# EasyEDA Pro project Modu-PI Motherboard.epro, schematic Schematic1
Create Date: 2025-08-20; Page Name: P1; Project Name: Modular Motherboard CM5; Schematic Name: Schematic1; Update Date: 2025-09-23; Company: EasyEDA.com; Page Size: A4; Version: V1.0
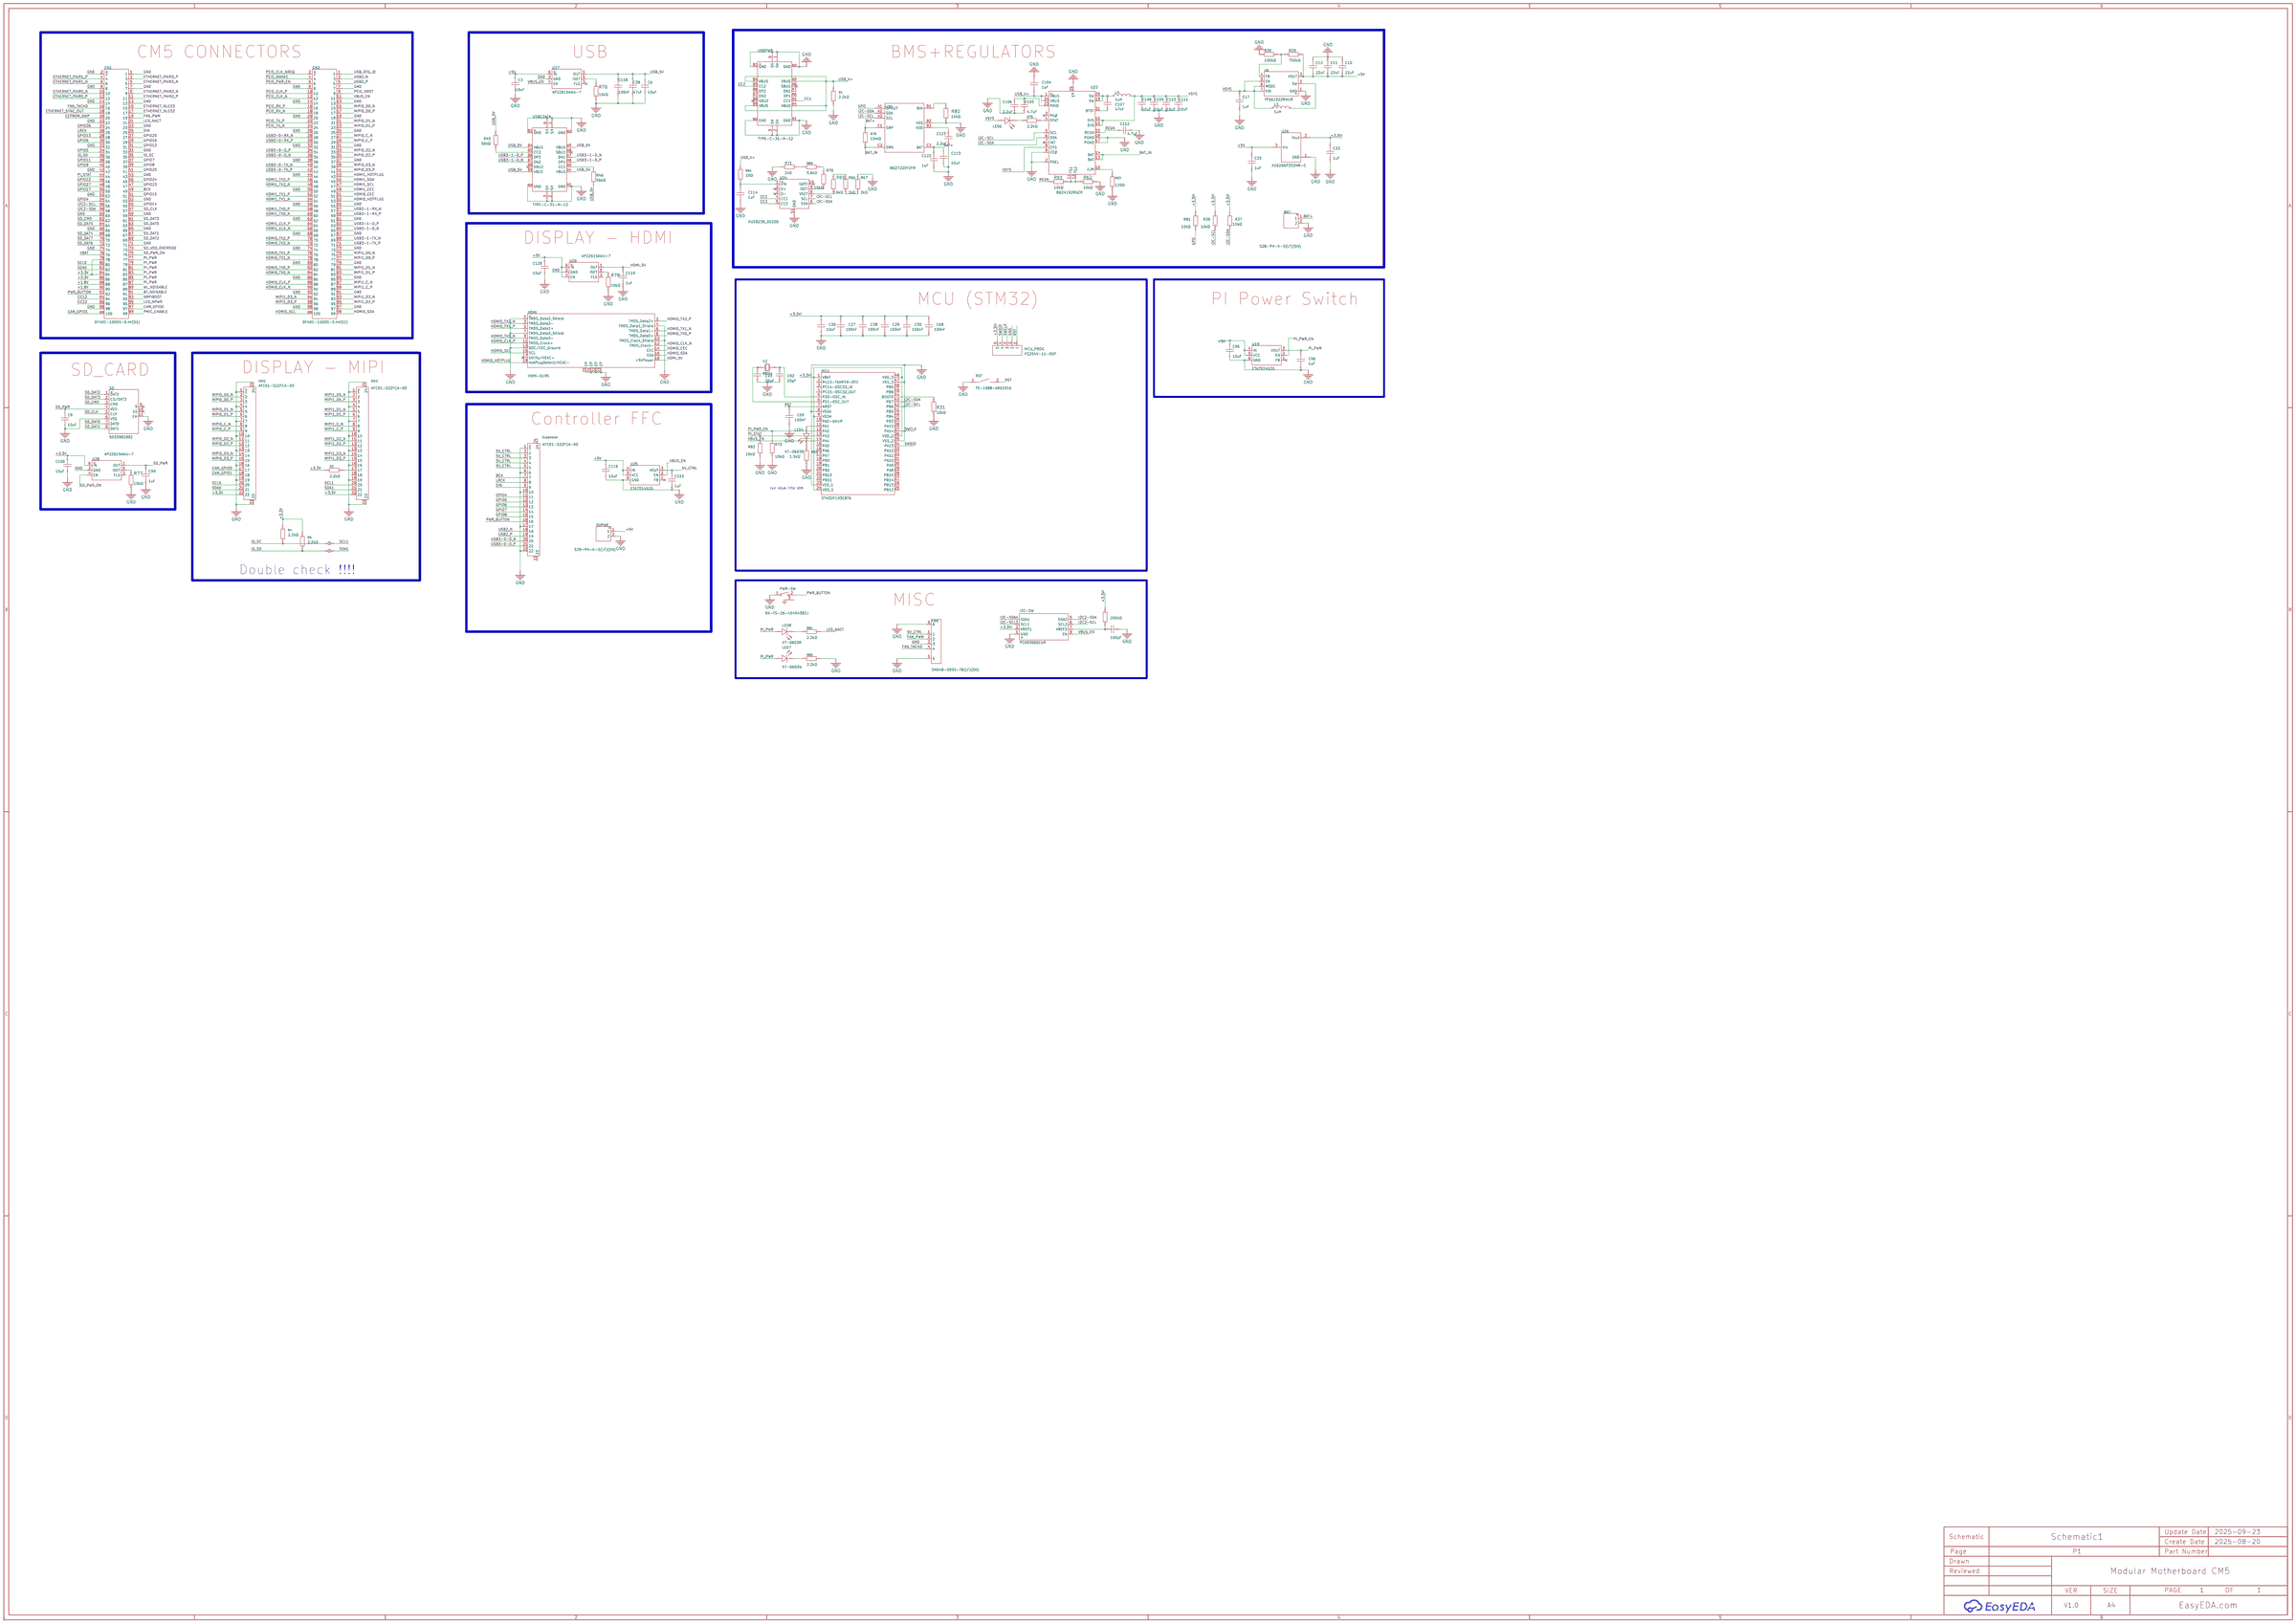
[diagram p0: schematic sheet]

## Parts
5VPWR  S2B-PH-K-S(LF)(SN)  [CONN-TH_S2B-PH-K-S-LF-SN]  (no BOM)
BAT  S2B-PH-K-S(LF)(SN)  [CONN-TH_S2B-PH-K-S-LF-SN]  (no BOM)
C3  10uF  [C0805]
C6  10uF  [C0805]
C9  10uF  [C0805]
C10  22uF  [C0805]
C11  22uF  [C0805]
C12  22uF  [C0805]
C17  1uF  [C0603]
C25  1uF  [C0603]
C26  10uF  [C0805]
C27  100nF  [C0402]
C28  100nF  [C0402]
C29  100nF  [C0402]
C30  100nF  [C0402]
C33  1uF  [C0603]
C38  47uF  [C1206]
C68  100nF  [C0402]
C69  100nF  [C0402]
C92  20pF  [C0402]
C93  20pF  [C0402]
C95  10uF  [C0805]
C96  1uF  [C0603]
C99  1uF  [C0603]
C100  10uF  [C0805]
C104  1uF  [C0603]
C105  4.7uF  [C0805]
C106  2.2uF  [C0805]
C107  47nF  [C0603]
C108  10uF  [C0805]
C109  10uF  [C0805]
C110  10uF  [C0805]
C111  10uF  [C0805]
C112  4.7uF  [C0603]
C113  10uF  [C0805]
C114  1uF  [C0603]
C115  1uF  [C0603]
C116  10uF  [C0805]
C118  100nF  [C0402]
C119  1uF  [C0603]
C120  10uF  [C0805]
C122  1uF  [C0603]
C123  2.2uF  [C0805]
C124  100pF  [C0603]
CN1  DF40C-100DS-0.4V(51)  [CONN-SMD_DF40C-100DS-0.4V-51]
CN2  DF40C-100DS-0.4V(51)  [CONN-SMD_DF40C-100DS-0.4V-51]
DSI0  AFC01-S22FCA-00  [FPC-SMD_P0.5-22P_FGS-XJ-H2.0]
DSI1  AFC01-S22FCA-00  [FPC-SMD_P0.5-22P_FGS-XJ-H2.0]
Expansion  AFC01-S22FCA-00  [FPC-SMD_P0.5-22P_FGS-XJ-H2.0]
FAN  SM04B-SRSS-TB(LF)(SN)  [CONN-SMD_4P-P1.00_SM04B-SRSS-TB-LF-SN]
HDMI  HDMI-519S  [HDMI-SMD_19P-P0.40-H-F_HDMI-519S]
I2C-SW  PCA9306DCUR  [SSOP-8_L2.0-W2.3-P0.50-LS3.1-BR]
L3  1uH  [IND-SMD_L4.4-W4.2]
L4  1uH  [IND-SMD_L4.4-W4.2]
LED4  KT-0603R  [LED0603-RD]
LED6  KT-0603R  [LED0603-RD]
LED7  KT-0603W  [LED0603-R-RD_WHITE]
LED8  KT-0603R  [LED0603-RD]
MCU  STM32F103C8T6  [LQFP-48_L7.0-W7.0-P0.50-LS9.0-BL]
MCU_PROG  PZ254V-11-05P  [HDR-TH_5P-P2.54-V-M]  (no BOM)
PWR-SW  BX-TS-26-454543BSJ  [SW-TH_3P-L4.5-W4.3-P3.00-LS1.9]  (no BOM)
R1  2.2kΩ  [R0402]
R3  2.2kΩ  [R0402]
R4  2.2kΩ  [R0402]
R5  2.2kΩ  [R0402]
R29  750kΩ  [R0603]
R30  100kΩ  [R0603]
R31  10kΩ  [R0603]
R32  1.5kΩ  [R0402]
R37  10kΩ  [R0402]
R38  10kΩ  [R0402]
R45  56kΩ  [R0402]
R46  56kΩ  [R0402]
R61  10kΩ  [R0603]
R62  10kΩ  [R0603]
R63  120Ω  [R0603]
R64  10Ω  [R0603]
R65  10kΩ  [R0603]
R66  2kΩ  [R0603]
R67  2kΩ  [R0603]
R69  5.6kΩ  [R0603]
R70  15kΩ  [R0603]
R71  2kΩ  [R0603]
R72  10kΩ  [R0402]
R75  2.2kΩ  [R0402]
R76  10kΩ  [R0603]
R77  10kΩ  [R0603]
R78  10kΩ  [R0603]
R79  10mΩ  [R1210]
R80  10kΩ  [R0603]
R81  10kΩ  [R0402]
R82  10kΩ  [R0402]
R84  2.2kΩ  [R0402]
R85  2.2kΩ  [R0402]
R86  200kΩ  [R0603]
RST  TS-1088-AR02016  [SW-SMD_L3.9-W3.0-P4.45]
SD  5033981892  [TF-SMD_503398-1892]
U9  TPS61022RWUR  [VQFN-7_L2.0-W2.0-P0.55-TL_RWU]
U19  ETA7014S2G  [SOT-23-6_L2.9-W1.6-P0.95-LS2.8-BL]
U23  BQ24192RGER  [QFN-24_L4.0-W4.0-P0.50-BL-EP2.7]
U24  HUSB238_002DD  [DFN-10_L3.0-W3.0-P0.50-BL-EP2.5]
U25  ETA7014S2G  [SOT-23-6_L2.9-W1.6-P0.95-LS2.8-BL]
U26  XC6206P332MR-G  [SOT-23-3_L2.9-W1.6-P1.90-LS2.8-BR]
U27  AP22615AWU-7  [SOT-26_L3.0-W1.6-P0.95-LS2.8-BL]
U28  AP22615AWU-7  [SOT-26_L3.0-W1.6-P0.95-LS2.8-BL]
U29  AP22615AWU-7  [SOT-26_L3.0-W1.6-P0.95-LS2.8-BL]
U30  BQ27220YZFR  [DSBGA-9_L1.7-W1.6-R3-C3-P0.50-BL]
USBCDATA  TYPE-C-31-M-12  [USB-C_SMD-TYPE-C-31-M-12]
USBPWR  TYPE-C-31-M-12  [USB-C_SMD-TYPE-C-31-M-12]
X2  8MHz  [CRYSTAL-SMD_L5.0-W3.2]

## Library data of the parts
5VPWR BAT = S2B-PH-K-S(LF)(SN): Pins Structure:1x2P Pitch:2mm Mounting Type:Right Angle Reference Series:PH Number of Pins:2P Number of Rows:1 Number of PINs Per Row:2 Row Spacing:- Current Rating:2A Contact Material:Brass Contact Plating:Tin Operating Temperature:-25℃~+85℃ Operating Te; LCSC Part Name: 1x2P 间距:2mm 弯插 系列:PH; Supplier Part: C173752; Manufacturer: JST; Supplier Footprint: 弯插,P=2mm; JLCPCB Part Class: Extended Part; Datasheet: https://item.szlcsc.com/datasheet/S2B-PH-K-S(LF)(SN)/185142.html; Supplier: LCSC; Pins Structure: 1x2P; Pitch: 2mm; Mounting Type: Right Angle; Reference Series: PH; Number of Pins: 2P; Number of Rows: 1; Number of PINs Per Row: 2; Current Rating: 2A; Contact Material: Brass; Contact Plating: Tin; Operating Temperature: -25℃~+85℃; Voltage Rating: 100V; Plastic Material: PA66; Flame Retardant Rating: UL94V-0; Supplementary Features: K Pin; Color: White; Z-Height of the Board: 4.8mm; X-Length of Bottom Edge on Board (Spacing Line): 5.9mm; Y-Width of Bottom Edge on Board: 7.6mm
C3 C6 C9 C26 C95 C100 C108-C111 C113 C116 C120 = CL21A106KAYNNNE_C15850: Capacitance: Tolerance:±10% Tolerance:±10% Voltage Rated: Temperature Coefficient:; LCSC Part Name: 10uF ±10% 25V; Supplier Part: C15850; Manufacturer: SAMSUNG(三星); Manufacturer Part: CL21A106KAYNNNE; Supplier Footprint: 0805; JLCPCB Part Class: Basic Part; Datasheet: https://atta.szlcsc.com/upload/public/pdf/source/20160218/1457707763339.pdf; Supplier: LCSC; Tolerance: ±10%
C10-C12 = CL21A226MAQNNNE: Capacitance: Tolerance:±20% Tolerance:±20% Voltage Rated: Temperature Coefficient:; LCSC Part Name: 22uF ±20% 25V; Supplier Part: C45783; Manufacturer: SAMSUNG(三星); Supplier Footprint: 0805; JLCPCB Part Class: Basic Part; Datasheet: https://atta.szlcsc.com/upload/public/pdf/source/20160218/1457707763339.pdf; Supplier: LCSC; Tolerance: ±20%
C17 C25 C33 C96 C99 C104 C114 C115 C119 C122 = CL10A105KB8NNNC: Capacitance: Tolerance:±10% Tolerance:±10% Voltage Rated: Temperature Coefficient:; LCSC Part Name: 1uF ±10% 50V; Supplier Part: C15849; Manufacturer: SAMSUNG(三星); Supplier Footprint: 0603; JLCPCB Part Class: Basic Part; Datasheet: https://atta.szlcsc.com/upload/public/pdf/source/20160218/1457707763339.pdf; Supplier: LCSC; Tolerance: ±10%
C27-C30 C68 C69 C118 = CL05B104KB54PNC: Capacitance: Tolerance:±10% Tolerance:±10% Voltage Rated: Temperature Coefficient:; LCSC Part Name: 100nF ±10% 50V; Supplier Part: C307331; Manufacturer: SAMSUNG(三星); Supplier Footprint: 0402; JLCPCB Part Class: Basic Part; Datasheet: https://atta.szlcsc.com/upload/public/pdf/source/20160218/1457707763339.pdf; Supplier: LCSC; Tolerance: ±10%
C38 = CL31A476MPHNNNE: Capacitance: Tolerance:±20% Tolerance:±20% Voltage Rated: Temperature Coefficient:; LCSC Part Name: 47uF ±20% 10V; Supplier Part: C96123; Manufacturer: SAMSUNG(三星); Supplier Footprint: 1206; JLCPCB Part Class: Basic Part; Datasheet: https://atta.szlcsc.com/upload/public/pdf/source/20160218/1457707763339.pdf; Supplier: LCSC; Tolerance: ±20%
C92 C93 = 0402CG200J500NT: Capacitance: Tolerance:±5% Tolerance:±5% Voltage Rated: Temperature Coefficient:; LCSC Part Name: 20pF ±5% 50V; Supplier Part: C1554; Manufacturer: FH(风华); Supplier Footprint: 0402; JLCPCB Part Class: Basic Part; Datasheet: https://atta.szlcsc.com/upload/public/pdf/source/20200305/C486355_26A10D38EF8C2A5C37091D0039909270.pdf; Supplier: LCSC; Tolerance: ±5%
C105 = CL21A475KAQNNNE: Capacitance:4.7uF Tolerance:±10% Tolerance:±10% Voltage Rating:25V Temperature Coefficient:X5R; LCSC Part Name: 4.7uF ±10% 25V; Supplier Part: C1779; Manufacturer: SAMSUNG(三星); Supplier Footprint: 0805; JLCPCB Part Class: Basic Part; Datasheet: https://item.szlcsc.com/datasheet/CL21A475KAQNNNE/2131.html; Supplier: LCSC; Tolerance: ±10%; Voltage Rating: 25V; Temperature Coefficient: X5R
C106 C123 = CL21A225KBQNNNE: Capacitance:2.2uF Tolerance:±10% Tolerance:±10% Voltage Rating:50V Temperature Coefficient:X5R; LCSC Part Name: 2.2uF ±10% 50V; Supplier Part: C377773; Manufacturer: SAMSUNG(三星); Supplier Footprint: 0805; JLCPCB Part Class: Basic Part; Datasheet: https://item.szlcsc.com/datasheet/CL21A225KBQNNNE/350246.html; Supplier: LCSC; Tolerance: ±10%; Voltage Rating: 50V; Temperature Coefficient: X5R
C107 = CL10B473KB8NNNC: Capacitance: Tolerance:±10% Tolerance:±10% Voltage Rated: Temperature Coefficient:; LCSC Part Name: 47nF ±10% 50V; Supplier Part: C1622; Manufacturer: SAMSUNG(三星); Supplier Footprint: 0603; JLCPCB Part Class: Basic Part; Datasheet: https://atta.szlcsc.com/upload/public/pdf/source/20160218/1457707763339.pdf; Supplier: LCSC; Tolerance: ±10%
C112 = CL10A475KO8NNNC: Capacitance: Tolerance:±10% Tolerance:±10% Voltage Rated: Temperature Coefficient:; LCSC Part Name: 4.7uF ±10% 16V; Supplier Part: C19666; Manufacturer: SAMSUNG(三星); Supplier Footprint: 0603; JLCPCB Part Class: Basic Part; Datasheet: https://atta.szlcsc.com/upload/public/pdf/source/20160218/1457707763339.pdf; Supplier: LCSC; Tolerance: ±10%
C124 = CL10C101JB8NNNC: Capacitance:100pF Tolerance:±5% Tolerance:±5% Voltage Rating:50V Temperature Coefficient:C0G; LCSC Part Name: 100pF ±5% 50V; Supplier Part: C14858; Manufacturer: SAMSUNG(三星); Supplier Footprint: 0603; JLCPCB Part Class: Basic Part; Datasheet: https://item.szlcsc.com/datasheet/CL10C101JB8NNNC/15530.html; Supplier: LCSC; Tolerance: ±5%; Voltage Rating: 50V; Temperature Coefficient: C0G
CN1 CN2 = DF40C-100DS-0.4V(51): Number of Pins:- Pitch:0.4mm Mounting Type:Surface Mount,Vertical Number of Rows:2 Current Rating:300mA Contact Plating:Gold Operating Temperature:-35℃~+85℃ Operating Temperature:-35℃~+85℃; LCSC Part Name: 间距:0.4mm 母 立贴; Supplier Part: C597931; Manufacturer: HRS(广濑); Supplier Footprint: SMD,P=0.4mm; JLCPCB Part Class: Extended Part; Datasheet: https://item.szlcsc.com/datasheet/DF40C-100DS-0.4V(51)/626547.html; Supplier: LCSC; Pitch: 0.4mm; Gender: Female; Mounting Style: Brick nogging; Number of Rows: 2; Current Rating (Max): 300mA; Contact Plating: Gold; Operating Temperature Range: -35℃~+85℃; Mounting Type: Surface Mount,Vertical; Current Rating: 300mA; Operating Temperature: -35℃~+85℃
DSI0 DSI1 Expansion = AFC01-S22FCA-00: Locking Feature:Clamshell Contact Type:Bottom Contact Number of Contacts:22P Pitch:0.5mm Mounting Type:卧贴 FFC, FCB Thickness:0.3mm FFC, FCB Thickness:0.3mm Height Above Board:2mm; LCSC Part Name: 间距:0.5mm P数:22P 翻盖式 下接; Supplier Part: C262668; Manufacturer: JS(钜硕电子); Supplier Footprint: SMD,P=0.5mm,卧贴; JLCPCB Part Class: Extended Part; Datasheet: https://atta.szlcsc.com/upload/public/pdf/source/20190816/C413942_2A72D1AC756EAE17EEDF756A339D4500.pdf; Supplier: LCSC; Locking Feature: Clamshell; Contact Type: Bottom Contact; Number of Contacts: 22P; Pitch: 0.5mm; Mounting Type: 卧贴; FFC, FCB Thickness: 0.3mm; Height Above Board: 2mm; Contact Material: Phosphor bronze; Contact Plating: Gold; Operating Temperature Range: -40℃~+85℃
FAN = SM04B-SRSS-TB(LF)(SN): Pins Structure:1x4P Pitch:1mm Mounting Style:Horizontal attachment Reference Series:SH Number of Pins:4P Number of Rows:1 Number of PINs Per Row:4 Row Spacing:- Current Rating (Max):1A Contact Material:Copper alloy Contact Plating:Tin Operating Temperatur; LCSC Part Name: 1x4P 间距:1mm 卧贴 系列:SH; Supplier Part: C160404; Manufacturer: JST; Supplier Footprint: SMD,P=1mm,卧贴; JLCPCB Part Class: Extended Part; Datasheet: https://atta.szlcsc.com/upload/public/pdf/source/20181010/C265335_7D2AD766CA0E20E745663C87507A223E.pdf; Supplier: LCSC; Pins Structure: 1x4P; Pitch: 1mm; Mounting Style: Horizontal attachment; Reference Series: SH; Number of Pins: 4P; Number of Rows: 1; Number of PINs Per Row: 4; Current Rating (Max): 1A; Contact Material: Copper alloy; Contact Plating: Tin; Operating Temperature Range: -25℃~+85℃; Rated Voltage (Max): 50V; Plastic Material: PA; Flame Retardant Rating: UL94V-0; Supplementary Features: Auxiliary soldering legs; Colour: White; Z-Height of the Board: 2.9mm; X-Length of Bottom Edge on Board (Spacing Line): 6mm; Y-Width of Bottom Edge on Board: 4.32mm
HDMI = HDMI-519S: Connector Type:HDMI-C Gender:Mother Number of Pins:19P Mounting Style:Horizontal attachment Current Rating (Max):- Rated Voltage (Max):- Operating Temperature Range:-10℃~+60℃ Operating Temperature Range:-10℃~+60℃; Supplier Part: C183605; Manufacturer: SOFNG(硕方); Supplier Footprint: SMD; JLCPCB Part Class: Extended Part; Datasheet: https://atta.szlcsc.com/upload/public/pdf/source/20180308/C183605_15204898542661414122.pdf; Supplier: LCSC; Connector Type: HDMI-C; Gender: Mother; Number of Pins: 19P; Mounting Style: Horizontal attachment; Operating Temperature Range: -10℃~+60℃
I2C-SW = PCA9306DCUR: Channel Type:Bidirectional Input Signal:- Output Signal:- Data Rate:- Voltage - Supply(VCCA):1.2V~3.3V Voltage - Supply(VCCA):1.2V~3.3V Voltage - Supply(VCCB):1.8V~5.5V Voltage - Supply(VCCB):1.8V~5.5V Number of Circuits:1 Number of Circuits:2 Output Type; LCSC Part Name: 2位双向电平转换器; Supplier Part: C33196; Manufacturer: TI(德州仪器); Supplier Footprint: VSSOP-8; JLCPCB Part Class: Extended Part; Datasheet: https://www.ti.com/cn/lit/gpn/pca9306; Supplier: LCSC; Channel Type: Bidirectional; Voltage - Supply(VCCA): 1.2V~3.3V; Voltage - Supply(VCCB): 1.8V~5.5V; Number of Circuits: 2; Output Type: Open Drain；Push-pull; Operating Temperature: -40℃~+85℃; Features: Automatic Direction Detection
L3 L4 = FXL0420-1R0-M: Inductance: Tolerance:±20% Tolerance:±20% Rated Current: Saturation Current (Isat):7A DC Resistance (DCR): Type:Integrated molded inductor; LCSC Part Name: 1uH ±20% 7A; Supplier Part: C167203; Manufacturer: cjiang(长江微电); Supplier Footprint: SMD,4.2x4.4mm; JLCPCB Part Class: Extended Part; Datasheet: https://atta.szlcsc.com/upload/public/pdf/source/20240426/3189EA8206330E2108542F9E34E540E7.pdf; Supplier: LCSC; Tolerance: ±20%; Saturation Current (Isat): 7A; Type: Integrated molded inductor
LED4 LED6 LED8 = KT-0603R: Emitted Color:Red Power Dissipation:- Forward Current:- Dominant Wavelength:- Dominant Wavelength:- Peak Wavelength:- Diode Configuration:- Lens Color:- Color Temperature:- Color Temperature:- Viewing Angle:- Mounting Sytle:- Operating Temperature:-40℃~+8; LCSC Part Name: 0603 红灯 高亮; Supplier Part: C2286; Manufacturer: KENTO; Supplier Footprint: 0603; JLCPCB Part Class: Basic Part; Datasheet: https://atta.szlcsc.com/upload/public/pdf/source/20160616/1466072038404.pdf; Supplier: LCSC; Emitted Color: Red; Operating Temperature: -40℃~+85℃
LED7 = KT-0603W: Emitted Color:White; LCSC Part Name: 0603 白灯 高亮; Supplier Part: C2290; Manufacturer: KENTO; Supplier Footprint: 0603; JLCPCB Part Class: Basic Part; Datasheet: https://atta.szlcsc.com/upload/public/pdf/source/20221101/4C23D5C85BA051E44A00B833D0A41468.pdf; Supplier: LCSC; Emitted Color: White
MCU = STM32F103C8T6: CPU Core:ARM-M3 CPU Maximum Speed:72MHz Program Storage Size:64KB Program Memory Type:FLASH Number of I/O:37 ADC (Bit):12bit Low Voltage Detection Threshold:2V~3.6V Low Voltage Detection Threshold:2V~3.6V Application Area:-; LCSC Part Name: 主流增强型ARM Cortex-M3 MCU，具有64 KB Flash、72 MHz CPU、电机控制、USB和CAN; Supplier Part: C8734; Manufacturer: ST(意法半导体); Supplier Footprint: LQFP-48(7x7); JLCPCB Part Class: Extended Part; Datasheet: https://atta.szlcsc.com/upload/public/pdf/source/20220812/8363ACEC51AD55ECEB84799464F7CB85.pdf; Supplier: LCSC; CPU Core: ARM-M3; CPU Maximum Speed: 72MHz; Program Storage Size: 64KB; Program Memory Type: FLASH; Number of I/O: 37; ADC (Bit): 12bit; Low Voltage Detection Threshold: 2V~3.6V
MCU_PROG = PZ254V-11-05P: Pin Structure:1x5P Pitch:2.54mm Row Spacing:- Circluar Pins/Square Pins:Policy Mounting Type:Straight Number of Rows:Single Row Number of Pins:5P Current Rating:- Voltage Rating (Max):- Length of Mating Pin:6mm Insulation Height:2.5mm Length of End Connec; LCSC Part Name: 1x5P 间距:2.54mm 方针 直插; Supplier Part: C492404; Manufacturer: XFCN(兴飞); Supplier Footprint: 插件,P=2.54mm; JLCPCB Part Class: Extended Part; Datasheet: https://atta.szlcsc.com/upload/public/pdf/source/20200309/C492404_E51533260F8710EFF5D4617281164C1D.pdf; Supplier: LCSC; Pin Structure: 1x5P; Pitch: 2.54mm; Circluar Pins/Square Pins: Policy; Mounting Type: Straight; Number of Rows: Single Row; Number of Pins: 5P; Length of Mating Pin: 6mm; Insulation Height: 2.5mm; Length of End Connection Pin: 3mm; Contact Material: Brass; Operating Temperature: -40℃~+105℃; Color: Black
PWR-SW = BX-TS-26-454543BSJ: Circuit:SPST Actuator Style:Round Button Operating Force:260gf Mounting Style:Direct Insert Switch Length:4.5mm Switch Width:4.5mm Switch Height:4.3mm Strike Gundam:Without bracket Contact Current:50mA Voltage Rating:12V Actuator/Cap Color:Black Pin Style; LCSC Part Name: 4.5x4.5x4.3边三脚; Supplier Part: C18078076; Manufacturer: Bossie(博锡); Supplier Footprint: 插件-3P,4.5x4.5mm; JLCPCB Part Class: Extended Part; Datasheet: https://atta.szlcsc.com/upload/public/pdf/source/20231017/C9E2CC52EFF4A1EA78B90A8989680BD6.pdf; Supplier: LCSC; Circuit: SPST; Actuator Style: Round Button; Operating Force: 260gf; Mounting Style: Direct Insert; Switch Length: 4.5mm; Switch Width: 4.5mm; Switch Height: 4.3mm; Strike Gundam: Without bracket; Contact Current: 50mA; Voltage Rating: 12V; Actuator/Cap Color: Black; Pin Style: PCPin; Mechanical Life: 100000 Times; Operating Temperature: -30℃~+80℃
R1 R3-R5 R75 R84 R85 = 0402WGF2201TCE: Type:Thick Film Resistors Resistance:2.2kΩ Tolerance:±1% Tolerance:±1% Power(Watts): Overload Voltage (Max): Temperature Coefficient:±100ppm/℃ Temperature Coefficient:±100ppm/℃ Operating Temperature Range:-55℃~+155℃ Operating Temperature Range:-55℃~+155℃; LCSC Part Name: 2.2kΩ ±1% 62.5mW 厚膜电阻; Supplier Part: C25879; Manufacturer: UNI-ROYAL(厚声); Supplier Footprint: 0402; JLCPCB Part Class: Basic Part; Datasheet: https://atta.szlcsc.com/upload/public/pdf/source/20200306/C422600_1E6D84923E4A46A82E41ADD87F860B5C.pdf; Supplier: LCSC; Type: Thick Film Resistors; Tolerance: ±1%; Temperature Coefficient: ±100ppm/℃; Operating Temperature Range: -55℃~+155℃
R29 = 0603WAF7503T5E: Type:Thick Film Resistors Resistance:750kΩ Tolerance:±1% Tolerance:±1% Power(Watts): Overload Voltage (Max): Temperature Coefficient:±100ppm/℃ Temperature Coefficient:±100ppm/℃ Operating Temperature Range:-55℃~+155℃ Operating Temperature Range:-55℃~+155℃; LCSC Part Name: 750kΩ ±1% 100mW 厚膜电阻; Supplier Part: C23240; Manufacturer: UNI-ROYAL(厚声); Supplier Footprint: 0603; JLCPCB Part Class: Extended Part; Datasheet: https://atta.szlcsc.com/upload/public/pdf/source/20200306/C422600_1E6D84923E4A46A82E41ADD87F860B5C.pdf; Supplier: LCSC; Type: Thick Film Resistors; Tolerance: ±1%; Temperature Coefficient: ±100ppm/℃; Operating Temperature Range: -55℃~+155℃
R30 = 0603WAF1003T5E: Type:Thick Film Resistors Resistance:100kΩ Tolerance:±1% Tolerance:±1% Power(Watts): Overload Voltage (Max): Temperature Coefficient:±100ppm/℃ Temperature Coefficient:±100ppm/℃ Operating Temperature Range:-55℃~+155℃ Operating Temperature Range:-55℃~+155℃; LCSC Part Name: 100kΩ ±1% 100mW 厚膜电阻; Supplier Part: C25803; Manufacturer: UNI-ROYAL(厚声); Supplier Footprint: 0603; JLCPCB Part Class: Basic Part; Datasheet: https://atta.szlcsc.com/upload/public/pdf/source/20200306/C422600_1E6D84923E4A46A82E41ADD87F860B5C.pdf; Supplier: LCSC; Type: Thick Film Resistors; Tolerance: ±1%; Temperature Coefficient: ±100ppm/℃; Operating Temperature Range: -55℃~+155℃
R31 R61 R62 R65 R76-R78 R80 = 0603WAF1002T5E: Type:Thick Film Resistors Resistance:10kΩ Tolerance:±1% Tolerance:±1% Power(Watts): Overload Voltage (Max): Temperature Coefficient:±100ppm/℃ Temperature Coefficient:±100ppm/℃ Operating Temperature Range:-55℃~+155℃ Operating Temperature Range:-55℃~+155℃; LCSC Part Name: 厚膜电阻 10kΩ ±1% 100mW; Supplier Part: C25804; Manufacturer: UNI-ROYAL(厚声); Supplier Footprint: 0603; JLCPCB Part Class: Basic Part; Datasheet: https://atta.szlcsc.com/upload/public/pdf/source/20200306/C422600_1E6D84923E4A46A82E41ADD87F860B5C.pdf; Supplier: LCSC; Type: Thick Film Resistors; Tolerance: ±1%; Temperature Coefficient: ±100ppm/℃; Operating Temperature Range: -55℃~+155℃
R32 = 0402WGF1501TCE: Type:Thick Film Resistors Resistance:1.5kΩ Tolerance:±1% Tolerance:±1% Power(Watts): Overload Voltage (Max): Temperature Coefficient:±100ppm/℃ Temperature Coefficient:±100ppm/℃ Operating Temperature Range:-55℃~+155℃ Operating Temperature Range:-55℃~+155℃; LCSC Part Name: 1.5kΩ ±1% 62.5mW 厚膜电阻; Supplier Part: C25867; Manufacturer: UNI-ROYAL(厚声); Supplier Footprint: 0402; JLCPCB Part Class: Basic Part; Datasheet: https://atta.szlcsc.com/upload/public/pdf/source/20200306/C422600_1E6D84923E4A46A82E41ADD87F860B5C.pdf; Supplier: LCSC; Type: Thick Film Resistors; Tolerance: ±1%; Temperature Coefficient: ±100ppm/℃; Operating Temperature Range: -55℃~+155℃
R37 R38 R72 R81 R82 = 0402WGF1002TCE: Type:Thick Film Resistors Resistance:10kΩ Tolerance:±1% Tolerance:±1% Power(Watts): Overload Voltage (Max): Temperature Coefficient:±100ppm/℃ Temperature Coefficient:±100ppm/℃ Operating Temperature Range:-55℃~+155℃ Operating Temperature Range:-55℃~+155℃; LCSC Part Name: 10kΩ ±1% 62.5mW 厚膜电阻; Supplier Part: C25744; Manufacturer: UNI-ROYAL(厚声); Supplier Footprint: 0402; JLCPCB Part Class: Basic Part; Datasheet: https://atta.szlcsc.com/upload/public/pdf/source/20200306/C422600_1E6D84923E4A46A82E41ADD87F860B5C.pdf; Supplier: LCSC; Type: Thick Film Resistors; Tolerance: ±1%; Temperature Coefficient: ±100ppm/℃; Operating Temperature Range: -55℃~+155℃
R45 R46 = 0402WGF5602TCE: Type:Thick Film Resistors Resistance:56kΩ Tolerance:±1% Tolerance:±1% Power(Watts): Overload Voltage (Max): Temperature Coefficient:±100ppm/℃ Temperature Coefficient:±100ppm/℃ Operating Temperature Range:-55℃~+155℃ Operating Temperature Range:-55℃~+155℃; LCSC Part Name: 56kΩ ±1% 62.5mW 厚膜电阻; Supplier Part: C25796; Manufacturer: UNI-ROYAL(厚声); Supplier Footprint: 0402; JLCPCB Part Class: Extended Part; Datasheet: https://atta.szlcsc.com/upload/public/pdf/source/20200306/C422600_1E6D84923E4A46A82E41ADD87F860B5C.pdf; Supplier: LCSC; Type: Thick Film Resistors; Tolerance: ±1%; Temperature Coefficient: ±100ppm/℃; Operating Temperature Range: -55℃~+155℃
R63 = 0603WAF1200T5E: Type:Thick Film Resistors Resistance: Tolerance:±1% Tolerance:±1% Power(Watts): Overload Voltage (Max): Temperature Coefficient:±100ppm/℃ Temperature Coefficient:±100ppm/℃ Operating Temperature Range:-55℃~+155℃ Operating Temperature Range:-55℃~+155℃; LCSC Part Name: 120Ω ±1% 100mW 厚膜电阻; Supplier Part: C22787; Manufacturer: UNI-ROYAL(厚声); Supplier Footprint: 0603; JLCPCB Part Class: Basic Part; Datasheet: https://atta.szlcsc.com/upload/public/pdf/source/20200306/C422600_1E6D84923E4A46A82E41ADD87F860B5C.pdf; Supplier: LCSC; Type: Thick Film Resistors; Tolerance: ±1%; Temperature Coefficient: ±100ppm/℃; Operating Temperature Range: -55℃~+155℃
R64 = 0603WAF100JT5E: Type:Thick Film Resistor Resistance:10Ω Tolerance:±1% Tolerance:±1% Power(Watts):100mW Voltage-Supply(Max):75V Temperature Coefficient:±400ppm/℃ Temperature Coefficient:±400ppm/℃ Operating Temperature:-55℃~+155℃ Operating Temperature:-55℃~+155℃; LCSC Part Name: 10Ω ±1% 100mW 厚膜电阻; Supplier Part: C22859; Manufacturer: UNI-ROYAL(厚声); Supplier Footprint: 0603; JLCPCB Part Class: Basic Part; Datasheet: https://item.szlcsc.com/datasheet/0603WAF100JT5E/23586.html; Supplier: LCSC; Type: Thick Film Resistor; Tolerance: ±1%; Power(Watts): 100mW; Voltage-Supply(Max): 75V; Temperature Coefficient: ±400ppm/℃; Operating Temperature: -55℃~+155℃
R66 R67 R71 = 0603WAF2001T5E: Type:Thick Film Resistor Resistance:2kΩ Tolerance:±1% Tolerance:±1% Power(Watts):100mW Voltage-Supply(Max):75V Temperature Coefficient:±100ppm/℃ Temperature Coefficient:±100ppm/℃ Operating Temperature:-55℃~+155℃ Operating Temperature:-55℃~+155℃; LCSC Part Name: 2kΩ ±1% 100mW 厚膜电阻; Supplier Part: C22975; Manufacturer: UNI-ROYAL(厚声); Supplier Footprint: 0603; JLCPCB Part Class: Basic Part; Datasheet: https://item.szlcsc.com/datasheet/0603WAF2001T5E/23702.html; Supplier: LCSC; Type: Thick Film Resistor; Tolerance: ±1%; Power(Watts): 100mW; Voltage-Supply(Max): 75V; Temperature Coefficient: ±100ppm/℃; Operating Temperature: -55℃~+155℃
R69 = 0603WAF5601T5E: Type:Thick Film Resistor Resistance:5.6kΩ Tolerance:±1% Tolerance:±1% Power(Watts):100mW Voltage-Supply(Max):75V Temperature Coefficient:±100ppm/℃ Temperature Coefficient:±100ppm/℃ Operating Temperature:-55℃~+155℃ Operating Temperature:-55℃~+155℃; LCSC Part Name: 5.6kΩ ±1% 100mW 厚膜电阻; Supplier Part: C23189; Manufacturer: UNI-ROYAL(厚声); Supplier Footprint: 0603; JLCPCB Part Class: Basic Part; Datasheet: https://item.szlcsc.com/datasheet/0603WAF5601T5E/23916.html; Supplier: LCSC; Type: Thick Film Resistor; Tolerance: ±1%; Power(Watts): 100mW; Voltage-Supply(Max): 75V; Temperature Coefficient: ±100ppm/℃; Operating Temperature: -55℃~+155℃
R70 = 0603WAF1502T5E: Type:Thick Film Resistor Resistance:15kΩ Tolerance:±1% Tolerance:±1% Power(Watts):100mW Voltage-Supply(Max):75V Temperature Coefficient:±100ppm/℃ Temperature Coefficient:±100ppm/℃ Operating Temperature:-55℃~+155℃ Operating Temperature:-55℃~+155℃; LCSC Part Name: 15kΩ ±1% 100mW 厚膜电阻; Supplier Part: C22809; Manufacturer: UNI-ROYAL(厚声); Supplier Footprint: 0603; JLCPCB Part Class: Basic Part; Datasheet: https://item.szlcsc.com/datasheet/0603WAF1502T5E/23536.html; Supplier: LCSC; Type: Thick Film Resistor; Tolerance: ±1%; Power(Watts): 100mW; Voltage-Supply(Max): 75V; Temperature Coefficient: ±100ppm/℃; Operating Temperature: -55℃~+155℃
R79 = 1210W2F100MT5E: Type:Thick Film Resistor Resistance:10mΩ Tolerance:±1% Tolerance:±1% Power(Watts):500mW Voltage-Supply(Max):200V Temperature Coefficient:±1500ppm/℃ Temperature Coefficient:±1500ppm/℃ Operating Temperature:-55℃~+155℃ Operating Temperature:-55℃~+155℃; LCSC Part Name: 10mΩ ±1% 500mW 厚膜电阻; Supplier Part: C473495; Manufacturer: UNI-ROYAL(厚声); Supplier Footprint: 1210; JLCPCB Part Class: Extended Part; Datasheet: https://item.szlcsc.com/datasheet/1210W2F100MT5E/479888.html; Supplier: LCSC; Type: Thick Film Resistor; Tolerance: ±1%; Power(Watts): 500mW; Voltage-Supply(Max): 200V; Temperature Coefficient: ±1500ppm/℃; Operating Temperature: -55℃~+155℃
R86 = 0603WAF2003T5E: Type:Thick Film Resistors Resistance:200kΩ Tolerance:±1% Tolerance:±1% Power(Watts): Overload Voltage (Max): Temperature Coefficient:±100ppm/℃ Temperature Coefficient:±100ppm/℃ Operating Temperature Range:-55℃~+155℃ Operating Temperature Range:-55℃~+155℃; LCSC Part Name: 200kΩ ±1% 100mW 厚膜电阻; Supplier Part: C25811; Manufacturer: UNI-ROYAL(厚声); Supplier Footprint: 0603; JLCPCB Part Class: Basic Part; Datasheet: https://atta.szlcsc.com/upload/public/pdf/source/20200306/C422600_1E6D84923E4A46A82E41ADD87F860B5C.pdf; Supplier: LCSC; Type: Thick Film Resistors; Tolerance: ±1%; Temperature Coefficient: ±100ppm/℃; Operating Temperature Range: -55℃~+155℃
RST = TS-1088-AR02016: Circuit:SPST Actuator Style:Round Button Operating Force:160gf Mounting Style:Brick nogging Switch Length:4mm Switch Width:3mm Switch Height:2mm Strike Gundam:不带 Contact Current:50mA Voltage Rating (DC):12V Insulation Resistance:100MΩ Actuator/Cap Color:B; LCSC Part Name: 4*3*2mm 立贴 轻触开关; Supplier Part: C720477; Manufacturer: XUNPU(讯普); Supplier Footprint: SMD; JLCPCB Part Class: Basic Part; Datasheet: https://atta.szlcsc.com/upload/public/pdf/source/20200810/C720475_60D09DD6C54279ADDB2DC25100F1CC11.pdf; Supplier: LCSC; Circuit: SPST; Actuator Style: Round Button; Operating Force: 160gf; Mounting Style: Brick nogging; Switch Length: 4mm; Switch Width: 3mm; Switch Height: 2mm; Strike Gundam: 不带; Contact Current: 50mA; Voltage Rating (DC): 12V; Insulation Resistance: 100MΩ; Actuator/Cap Color: Black; Pin Style: SMDSplicing; Mechanical Life: 10万次; Operating Temperature: -30℃~+80℃
SD = 5033981892: Card Connection Mode:Self-bouncing Card Type:MicroSD card (TF card) Connector Type:Card Slot Additional Card Detection Pins:- Supplementary Features:- Maximum Body Height:1.28mm Operating Temperature Range:-25℃~+85℃ Operating Temperature Range:-25℃~+85℃; LCSC Part Name: 自弹式 MicroSD卡(TF卡) 卡座; Supplier Part: C428492; Manufacturer: MOLEX; Supplier Footprint: SMD; JLCPCB Part Class: Extended Part; Datasheet: https://www.molex.com/content/dam/molex/molex-dot-com/products/automated/en-us/salesdrawingpdf/503/503398/5033981892_sd.pdf?inline; Supplier: LCSC; Card Connection Mode: Self-bouncing; Card Type: MicroSD card (TF card); Connector Type: Card Slot; Maximum Body Height: 1.28mm; Operating Temperature Range: -25℃~+85℃
U9 = TPS61022RWUR: Function:boost converterType Output Type:Adjustable Input Voltage:500mV~5.5V Input Voltage:500mV~5.5V Output Voltage:2.2V~5.5V Output Voltage:2.2V~5.5V Output Current (Max):- Switching Frequency:1MHz；600kHz Operating Temperature:-40℃~+125℃@(TJ) Operating; Supplier Part: C915088; Manufacturer: TI(德州仪器); Supplier Footprint: VQFN-7(2x2); JLCPCB Part Class: Extended Part; Datasheet: https://www.ti.com/cn/lit/gpn/tps61022; Supplier: LCSC; Function: boost converterType; Output Type: Adjustable; Input Voltage: 500mV~5.5V; Output Voltage: 2.2V~5.5V; Switching Frequency: 1MHz；600kHz; Operating Temperature: -40℃~+125℃@(TJ); Synchronous Rectification: Yes; Number of Outputs: 1; Topology: Boost; Switch tube (built-in/external): 内置
U19 U25 = ETA7014S2G: Type:High-side switch Number of Channels:1 Control Input Logic:Active High Output Current:5A Voltage - Supply:4V~36V Voltage - Supply:4V~36V RDS(on):35mΩ Operating Temperature -:-40℃~+85℃ Operating Temperature -:-40℃~+85℃; Supplier Part: C7465500; Manufacturer: ETA(钰泰); Supplier Footprint: SOT23-6; JLCPCB Part Class: Extended Part; Datasheet: https://atta.szlcsc.com/upload/public/pdf/source/20230717/2B472CB1BF6DFB47746E529AC2956F59.pdf; Supplier: LCSC; Type: High-side switch; Number of Channels: 1; Control Input Logic: Active High; Output Current: 5A; Voltage - Supply: 4V~36V; RDS(on): 35mΩ; Operating Temperature	-: -40℃~+85℃
U23 = BQ24192RGER: The Chip Type:- Voltage - Supply:3.9V~17V Voltage - Supply:3.9V~17V Charge Current - Max:4.5A Charging Saturation Voltage:4.208V End-Off Voltage:2.4V Type of Battery:Lithium Battery Number of Cells:1 Number of Cells:1 Operating Temperature:-40℃~+85℃ Opera; LCSC Part Name: 具有窄范围VDC电源路径管理和USB OTG的I²C控制4.5A单节USB/适配器充电器; Supplier Part: C2876711; Manufacturer: TI(德州仪器); Supplier Footprint: VQFN-24-EP(4x4); JLCPCB Part Class: Extended Part; Datasheet: https://www.ti.com/cn/lit/gpn/bq24192; Supplier: LCSC; Voltage - Supply: 3.9V~17V; Charge Current - Max: 4.5A; Charging Saturation Voltage: 4.208V; End-Off Voltage: 2.4V; Type of Battery: Lithium Battery; Number of Cells: 1; Operating Temperature: -40℃~+85℃; Battery Temperature Detection: Support; 0V Battery Charge: Support; Supply Current (Iq): 15uA
U24 = HUSB238_002DD: Supplier Part: C7471904; Manufacturer: Hynetek(慧能泰); Supplier Footprint: DFN-10L(3x3); JLCPCB Part Class: Extended Part; Datasheet: https://item.szlcsc.com/datasheet/HUSB238_002DD/8528237.html; Supplier: LCSC
U26 = XC6206P332MR-G_C5446: Output Type: Maximum Input Voltage:6V Output Voltage:3.3V Output Voltage:3.3V MAX Output Current:200mA Power Supply Rejection Ratio (PSRR):- Dropout Voltage:680mV@(100mA) Output Polarity:Positive electrode Number of Outputs:1; LCSC Part Name: 输入6V 输出3.3V 200mA; Supplier Part: C5446; Manufacturer: TOREX(特瑞仕); Supplier Footprint: SOT-23-3L; JLCPCB Part Class: Basic Part; Datasheet: https://atta.szlcsc.com/upload/public/pdf/source/20130823/1457706639850.pdf; Supplier: LCSC; Maximum Input Voltage: 6V; Output Voltage: 3.3V; MAX Output Current: 200mA; Dropout Voltage: 680mV@(100mA); Output Polarity: Positive electrode; Number of Outputs: 1
U27-U29 = AP22615AWU-7: Type:High Side Switch Number of Channels:1 Control Input Logic:Active Low；Active High Maximum Continuous Current:3A Voltage - Supply:3V~5.5V Voltage - Supply:3V~5.5V RDS(on):40mΩ Operating Temperature -:-40℃~+85℃ Operating Temperature -:-40℃~+85℃; Supplier Part: C2680357; Manufacturer: DIODES(美台); Supplier Footprint: TSOT-23-6; JLCPCB Part Class: Extended Part; Datasheet: https://item.szlcsc.com/datasheet/AP22615AWU-7/2772274.html; Supplier: LCSC; Type: High Side Switch; Number of Channels: 1; Control Input Logic: Active Low；Active High; Maximum Continuous Current: 3A; Voltage - Supply: 3V~5.5V; RDS(on): 40mΩ; Operating Temperature	-: -40℃~+85℃
U30 = BQ27220YZFR: The Chip Type:Battery Monitoring IC Voltage - Supply:2.45V~4.5V Voltage - Supply:2.45V~4.5V Type of Battery:Lithium-ion/Polymer Number of Cells:1 Number of Cells:1 Operating Temperature:-40℃~+85℃ Operating Temperature:-40℃~+85℃; LCSC Part Name: 单节电池CEDV电量计; Supplier Part: C528617; Manufacturer: TI(德州仪器); Supplier Footprint: DSBGA-9; JLCPCB Part Class: Extended Part; Datasheet: https://www.ti.com/cn/lit/gpn/bq27220; Supplier: LCSC; The Chip Type: Battery Monitoring IC; Voltage - Supply: 2.45V~4.5V; Type of Battery: Lithium-ion/Polymer; Number of Cells: 1; Operating Temperature: -40℃~+85℃
USBCDATA USBPWR = TYPE-C-31-M-12: Connector Type:Type-C Standard:- Gender:Female Mounting Style:- Number of Contacts:16P Number of Ports:1 Current Rating - Power (Max):5A Operating Temperature Range:- Operating Temperature Range:-; LCSC Part Name: Type-C 母; Supplier Part: C165948; Manufacturer: 韩国韩荣; Supplier Footprint: SMD; JLCPCB Part Class: Extended Part; Datasheet: https://atta.szlcsc.com/upload/public/pdf/source/20220525/466408E853115E789EDB0DDC29077C05.pdf; Supplier: LCSC; Connector Type: Type-C; Gender: Female; Number of Contacts: 16P; Number of Ports: 1; Current Rating - Power (Max): 5A
X2 = X50328MSB2GI: Type:Surface Mount Crystal Frequency:8MHz Normal temperature Frequency Tolerance:±10ppm Normal temperature Frequency Tolerance:±10ppm Load Capacitance: Frequency Stability:±20ppm Frequency Stability:±20ppm Operating Temperature:-40℃~+85℃ Operating Tempera; LCSC Part Name: 8MHz ±10ppm 20pF; Supplier Part: C115962; Manufacturer: YXC(扬兴晶振); Supplier Footprint: SMD5032; JLCPCB Part Class: Basic Part; Datasheet: https://atta.szlcsc.com/upload/public/pdf/source/20240329/44922B0AF7B60E58E9B66993B6077277.pdf; Supplier: LCSC; Type: Surface Mount Crystal; Normal temperature Frequency Tolerance: ±10ppm; Frequency Stability: ±20ppm; Operating Temperature: -40℃~+85℃

## Nets
5V_CTRL: C115.2 Expansion.2 Expansion.3 Expansion.4 Expansion.5 FAN.1 U25.3(VOUT)
+1.8V: CN1.88 CN1.90
+3.3V: C100.2 CN1.78 CN1.84 CN1.86 DSI0.22 DSI1.22 R3.1 R4.1 R5.1 U28.6(IN)
+3.3VI: C26.1 C27.1 C28.1 C29.1 C30.1 C33.1 C68.1 I2C-SW.2(VREF1) MCU.1(VBAT) MCU.9(VDDA) MCU.24(VDD_1) MCU.36(VDD_2) MCU.48(VDD_3) MCU_PROG.5 R37.1 R38.1 R81.1 R86.2 U26.2(Vout)
+5V: 5VPWR.1 C3.1 C10.1 C11.1 C12.1 C25.1 C95.2 C116.2 C120.2 R29.2 U9.3(VOUT) U19.4(IN) U19.5(VCC) U25.4(IN) U25.5(VCC) U26.3(Vin) U27.6(IN) U29.4(EN) U29.6(IN)
GND: 5VPWR.2 BAT.2 C3.2 C6.2 C9.2 C10.2 C11.2 C12.2 C17.2 C25.2 C26.2 C27.2 C28.2 C29.2 C30.2 C33.2 C38.2 C68.2 C69.2 C92.2 C93.2 C95.1 C96.1 C99.1 C100.1 C104.1 C105.2 C106.1 C108.2 C109.2 C110.2 C111.2 C112.2 C113.2 C114.1 C115.1 C116.1 C118.2 C119.1 C120.1 C122.2 C123.1 C124.2 CN1.1 CN1.2 CN1.7 CN1.8 CN1.13 CN1.14 CN1.22 CN1.23 CN1.32 CN1.33 CN1.42 CN1.43 CN1.52 CN1.53 CN1.59 CN1.60 CN1.65 CN1.66 CN1.71 CN1.74 CN1.98 CN2.7 CN2.8 CN2.13 CN2.14 CN2.19 CN2.20 CN2.25 CN2.26 CN2.31 CN2.32 CN2.37 CN2.38 CN2.44 CN2.50 CN2.55 CN2.56 CN2.61 CN2.62 CN2.67 CN2.68 CN2.73 CN2.74 CN2.79 CN2.80 CN2.85 CN2.86 CN2.91 CN2.92 CN2.97 CN2.98 DSI0.1 DSI0.4 DSI0.7 DSI0.10 DSI0.13 DSI0.16 DSI0.19 DSI0.23 DSI0.24 DSI1.1 DSI1.4 DSI1.7 DSI1.10 DSI1.13 DSI1.16 DSI1.19 DSI1.23 DSI1.24 Expansion.1 Expansion.6 Expansion.10 Expansion.17 Expansion.22 FAN.3 FAN.5 FAN.6 HDMI.1(TMDS_Data2_Shield) HDMI.4(TMDS_Data1_Shield) HDMI.7(TMDS_Data0_Shield) HDMI.10(TMDS_Clock_Shield) HDMI.13(DDC/CEC_Ground) HDMI.20(EP) HDMI.21(EP) HDMI.22(EP) HDMI.23(EP) I2C-SW.1(GND) MCU.8(VSSA) MCU.23(VSS_1) MCU.35(VSS_2) MCU.47(VSS_3) MCU_PROG.2 PWR-SW.1 R1.2 R30.1 R31.2 R32.2 R62.1 R63.2 R67.1 R71.1 R72.2 R76.1 R77.1 R78.1 R80.1 R82.2 R85.1 RST.1 SD.6(VSS) SD.11(EH) U9.1(GND) U19.6(GND) U23.2(PSEL) U23.9(CE#) U23.17(PGND) U23.18(PGND) U23.25(EP) U24.11(GND) U25.6(GND) U26.1(GND) U27.2(GND) U28.2(GND) U29.2(GND) U30.B2(VSS) USBCDATA.0(SH) USBCDATA.1(SH) USBCDATA.2(SH) USBCDATA.3(SH) USBCDATA.A1(GND) USBCDATA.A12(GND) USBCDATA.B1(GND) USBCDATA.B12(GND) USBPWR.0(SH) USBPWR.1(SH) USBPWR.2(SH) USBPWR.3(SH) USBPWR.A1(GND) USBPWR.A12(GND) USBPWR.B1(GND) USBPWR.B12(GND)
VBAT: CN1.76
VBUS_EN: CN2.11 I2C-SW.8(EN) MCU.14(PA4) U25.2(EN) U27.4(EN)
BAT+: BAT.1 C113.1 C122.1 R79.1 U30.C1(SRP) U30.C3(BAT)
BAT_IN: R79.2 U23.13(BAT) U23.14(BAT) U30.C2(SRN)
BCK: CN1.49 Expansion.7
BT_NDISABLE: CN1.91
CAM_GPIO0: CN1.97 DSI0.17
CAM_GPIO1: CN1.100 DSI0.18
CC1: U24.4(CC1) USBPWR.A5(CC1)
CC2: U24.5(CC2) USBPWR.B5(CC2)
CC12: CN1.94
CC22: CN1.96
DIN: CN1.25 Expansion.9
EEPROM_NWP: CN1.20
ETHERNET_NLED2: CN1.17
ETHERNET_NLED3: CN1.15
ETHERNET_PAIR0_N: CN1.10
ETHERNET_PAIR0_P: CN1.12
ETHERNET_PAIR1_N: CN1.6
ETHERNET_PAIR1_P: CN1.4
ETHERNET_PAIR2_N: CN1.9
ETHERNET_PAIR2_P: CN1.11
ETHERNET_PAIR3_N: CN1.5
ETHERNET_PAIR3_P: CN1.3
ETHERNET_SYNC_OUT: CN1.18
FAN_PWM: CN1.19 FAN.2
FAN_TACHO: CN1.16 FAN.4
GPIO4: CN1.54 Expansion.11
GPIO5: CN1.34 Expansion.12
GPIO6: CN1.30 Expansion.13
GPIO7: CN1.37 Expansion.14
GPIO8: CN1.39 Expansion.15
GPIO9: CN1.40
GPIO11: CN1.38
GPIO12: CN1.31
GPIO13: CN1.28
GPIO14: CN1.55
GPIO15: CN1.51
GPIO16: CN1.29
GPIO17: CN1.50
GPIO20: CN1.27
GPIO22: CN1.46
GPIO23: CN1.47
GPIO24: CN1.45
GPIO25: CN1.41
GPIO26: CN1.24
GPIO27: CN1.48
GPO: R81.2 U30.A1(GPOUT)
HDMI0_CEC: CN2.51 HDMI.14(CEC)
HDMI0_CLK_N: CN2.90 HDMI.12(TMDS_Clock-)
HDMI0_CLK_P: CN2.88 HDMI.11(TMDS_Clock+)
HDMI0_HOTPLUG: CN2.53 HDMI.19(HotPlugDetect/HEAC-)
HDMI0_SCL: CN2.100 HDMI.15(SCL)
HDMI0_SDA: CN2.99 HDMI.16(SDA)
HDMI0_TX0_N: CN2.84 HDMI.9(TMDS_Data0-)
HDMI0_TX0_P: CN2.82 HDMI.8(TMDS_Data0+)
HDMI0_TX1_N: CN2.78 HDMI.6(TMDS_Data1-)
HDMI0_TX1_P: CN2.76 HDMI.5(TMDS_Data1+)
HDMI0_TX2_N: CN2.72 HDMI.3(TMDS_Data2-)
HDMI0_TX2_P: CN2.70 HDMI.2(TMDS_Data2+)
HDMI1_CEC: CN2.49
HDMI1_CLK_N: CN2.66
HDMI1_CLK_P: CN2.64
HDMI1_HOTPLUG: CN2.43
HDMI1_SCL: CN2.47
HDMI1_SDA: CN2.45
HDMI1_TX0_N: CN2.60
HDMI1_TX0_P: CN2.58
HDMI1_TX1_N: CN2.54
HDMI1_TX1_P: CN2.52
HDMI1_TX2_N: CN2.48
HDMI1_TX2_P: CN2.46
HDMI_5V: C119.2 HDMI.18(+5VPower) U29.1(OUT)
I2C2-SCL: CN1.56 I2C-SW.6(SCL2)
I2C2-SDA: CN1.58 I2C-SW.5(SDA2)
I2C-SCL: I2C-SW.3(SCL1) MCU.42(PB6) R38.2 U23.5(SCL) U24.7(SCL) U30.A3(SCL)
I2C-SDA: I2C-SW.4(SDA1) MCU.43(PB7) R37.2 U23.6(SDA) U24.6(SDA) U30.A2(SDA)
ID_SC: CN1.35 DSI1.20 R4.2
ID_SD: CN1.36 DSI1.21 R5.2
LED_NACT: CN1.21 R84.1
LED_NPWR: CN1.95
LRCK: CN1.26 Expansion.8
MIPI0_C_N: CN2.27 DSI0.8
MIPI0_C_P: CN2.29 DSI0.9
MIPI0_D0_N: CN2.15 DSI0.2
MIPI0_D0_P: CN2.17 DSI0.3
MIPI0_D1_N: CN2.21 DSI0.5
MIPI0_D1_P: CN2.23 DSI0.6
MIPI0_D2_N: CN2.33 DSI0.11
MIPI0_D2_P: CN2.35 DSI0.12
MIPI0_D3_N: CN2.39 DSI0.14
MIPI0_D3_P: CN2.41 DSI0.15
MIPI1_C_N: CN2.87 DSI1.8
MIPI1_C_P: CN2.89 DSI1.9
MIPI1_D0_N: CN2.75 DSI1.2
MIPI1_D0_P: CN2.77 DSI1.3
MIPI1_D1_N: CN2.81 DSI1.5
MIPI1_D1_P: CN2.83 DSI1.6
MIPI1_D2_N: CN2.93 DSI1.11
MIPI1_D2_P: CN2.95 DSI1.12
MIPI1_D3_N: CN2.94 DSI1.14
MIPI1_D3_P: CN2.96 DSI1.15
NRPIBOOT: CN1.93
PCIE_CLK_N: CN2.12
PCIE_CLK_NREQ: CN2.2
PCIE_CLK_P: CN2.10
PCIE_NRST: CN2.9
PCIE_NWAKE: CN2.4
PCIE_PWR_EN: CN2.6
PCIE_RX_N: CN2.18
PCIE_RX_P: CN2.16
PCIE_TX_N: CN2.24
PCIE_TX_P: CN2.22
PI_PWR: C96.2 CN1.77 CN1.79 CN1.81 CN1.83 CN1.85 CN1.87 LED7.1(A) LED8.2(A) U19.3(VOUT)
PI_PWR_EN: MCU.12(PA2) R72.1 U19.2(EN)
PI_STAT: CN1.44 MCU.13(PA3) R82.1
PMIC_ENABLE: CN1.99
PWR_BUTTON: CN1.92 Expansion.16 PWR-SW.2
REGN: C112.1 R61.2 U23.22(REGN)
RST: C69.1 MCU.7(NRST) MCU_PROG.1 RST.2
SCL0: CN1.80 DSI0.20
SD_CLK: CN1.57 SD.5(CLK)
SD_CMD: CN1.62 SD.3(CMD)
SD_DAT0: CN1.63 SD.7(DAT0)
SD_DAT1: CN1.67 SD.8(DAT1)
SD_DAT2: CN1.69 SD.1(DAT2)
SD_DAT3: CN1.61 SD.2(CD/DAT3)
SD_DAT4: CN1.68
SD_DAT5: CN1.64
SD_DAT6: CN1.72
SD_DAT7: CN1.70
SD_PWR: C9.1 C99.2 SD.4(VDD) U28.1(OUT)
SD_PWR_ON: CN1.75 U28.4(EN)
SD_VDD_OVERRIDE: CN1.73
SDA0: CN1.82 DSI0.21
SWCLK: MCU.37(PA14) MCU_PROG.3
SWDIO: MCU.34(PA13) MCU_PROG.4
USB2_N: CN2.3 Expansion.18
USB2_P: CN2.5 Expansion.19
USB3-0-D_N: CN2.36 Expansion.20
USB3-0-D_P: CN2.34 Expansion.21
USB3-0-RX_N: CN2.28
USB3-0-RX_P: CN2.30
USB3-0-TX_N: CN2.40
USB3-0-TX_P: CN2.42
USB3-1-D_N: CN2.65 USBCDATA.A7(DN1) USBCDATA.B7(DN2)
USB3-1-D_P: CN2.63 USBCDATA.A6(DP1) USBCDATA.B6(DP2)
USB3-1-RX_N: CN2.57
USB3-1-RX_P: CN2.59
USB3-1-TX_N: CN2.69
USB3-1-TX_P: CN2.71
USB_5V: C6.1 C38.1 C118.1 R45.2 R46.2 U27.1(OUT) USBCDATA.A4(VBUS) USBCDATA.A9(VBUS) USBCDATA.B4(VBUS) USBCDATA.B9(VBUS)
USB_OTG_ID: CN2.1
USB_V+: C104.2 R1.1 R64.2 U23.1(VBUS) U23.24(VBUS) USBPWR.A4(VBUS) USBPWR.A9(VBUS) USBPWR.B4(VBUS) USBPWR.B9(VBUS)
VSYS: C17.1 C108.1 C109.1 C110.1 C111.1 L3.1 L4.2 LED6.2(A) U9.5(EN) U9.6(MODE) U9.7(VIN) U23.8(OTG) U23.15(SYS) U23.16(SYS)
WL_NDISABLE: CN1.89
$1N24726: DSI1.17 R3.2
$1N24782: LED8.1(K) R84.2
$1N24818: L3.2 U9.2(SW)
$1N24821: R29.1 R30.2 U9.4(FB)
$1N70030: MCU.44(BOOT0) R31.1
$1N70045: LED4.2(A) MCU.11(PA1)
$1N70046: LED4.1(K) R32.1
$1N70476: C92.1 MCU.5(PD0-OSC_IN) X2.2(OSC2)
$1N70509: C93.1 MCU.6(PD1-OSC_OUT) X2.1(OSC1)
$1N135374: C105.1 C106.2 U23.23(PMID)
$1N135610: R75.1 U23.4(STAT)
$1N135881: LED6.1(K) R75.2
$1N138376: R61.1 R62.2 U23.11(TS1) U23.12(TS2)
$1N138450: C107.1 L4.1 U23.19(SW) U23.20(SW)
$1N140892: C107.2 U23.21(BTST)
$1N146466: R63.1 U23.10(ILIM)
$1N152108: R76.2 U27.5(ISET)
$1N152319: R45.1 USBCDATA.B5(CC2)
$1N152322: R46.1 USBCDATA.A5(CC1)
$1N152617: C114.2 R64.1 U24.1(VIN)
$1N153293: R70.2 U24.9(ISET)
$1N153297: R69.2 R70.1
$1N153316: R69.1 R71.2
$1N153336: R65.1 U24.8(VSET)
$1N153345: R65.2 R66.1
$1N153351: R66.2 R67.2
$1N160115: LED7.2(K) R85.2
$1N168575: R77.2 U28.5(ISET)
$1N168802: R78.2 U29.5(ISET)
$1N180315: C123.2 U30.B3(VDD)
$1N180412: R80.2 U30.B1(BIN)
$1N204037: C124.1 I2C-SW.7(VREF2) R86.1

Not connected (* = marked no-connect by the designer): DSI1 18; Expansion 23 24; HDMI 17(Utility/HEAC+)*; MCU 2(PC13-TAMPER-RTC) 3(PC14-OSC32_IN) 4(PC15-OSC32_OUT) 10(PA0-WKUP) 15(PA5) 16(PA6) 17(PA7) 18(PB0) 19(PB1) 20(PB2) 21(PB10) 22(PB11) 25(PB12) 26(PB13) 27(PB14) 28(PB15) 29(PA8) 30(PA9) 31(PA10) 32(PA11) 33(PA12) 38(PA15) 39(PB3) 40(PB4) 41(PB5) 45(PB8) 46(PB9); PWR-SW 3(GND); SD 9* 10*; U19 1(FB)*; U23 3(PG#)* 7(INT)*; U24 2(D+)* 3(D-)* 10(GATE)*; U25 1(FB)*; U27 3(FLG)*; U28 3(FLG); U29 3(FLG); USBCDATA A8(SBU1)* B8(SBU2)*; USBPWR A6(DP1) A7(DN1) A8(SBU1)* B6(DP2) B7(DN2) B8(SBU2)*

## Notes on the sheet
- CM5 CONNECTORS
- USB
- BMS+REGULATORS
- DISPLAY - HDMI
- MCU (STM32)
- PI Power Switch
- DISPLAY - MIPI
- SD_CARD
- Controller FFC
- run vbus into stm
- Double check !!!!
- MISC
